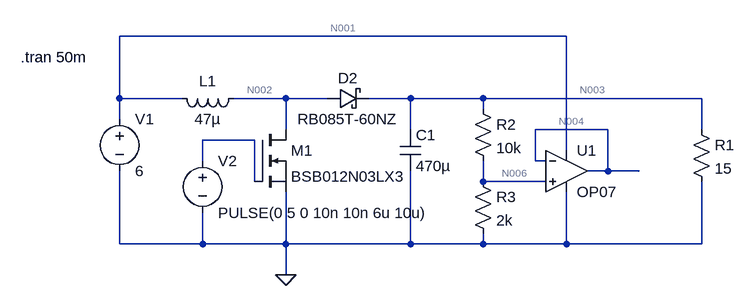
[diagram p0: schematic boost_DC-DC.asc]
boost_DC-DC.asc, the LTspice schematic file:
Version 4.1
SHEET 1 976 680
WIRE 672 -80 -16 -80
WIRE -16 16 -16 -80
WIRE 80 16 -16 16
WIRE 240 16 160 16
WIRE 304 16 240 16
WIRE 432 16 368 16
WIRE 544 16 432 16
WIRE 880 16 544 16
WIRE 544 32 544 16
WIRE -16 48 -16 16
WIRE 240 64 240 16
WIRE 432 64 432 16
WIRE 736 64 624 64
WIRE 880 64 880 16
WIRE 192 80 112 80
WIRE 672 96 672 -80
WIRE 112 112 112 80
WIRE 624 112 624 64
WIRE 640 112 624 112
WIRE 736 128 736 64
WIRE 736 128 704 128
WIRE 784 128 736 128
WIRE 192 144 192 80
WIRE 544 144 544 112
WIRE 640 144 544 144
WIRE -16 240 -16 128
WIRE 112 240 112 192
WIRE 112 240 -16 240
WIRE 240 240 240 160
WIRE 240 240 112 240
WIRE 432 240 432 128
WIRE 432 240 240 240
WIRE 544 240 544 224
WIRE 544 240 432 240
WIRE 672 240 672 160
WIRE 672 240 544 240
WIRE 880 240 880 144
WIRE 880 240 672 240
WIRE 240 288 240 240
FLAG 240 288 0
SYMBOL voltage -16 32 R0
WINDOW 123 0 0 Left 0
WINDOW 39 0 0 Left 0
SYMATTR InstName V1
SYMATTR Value 6
SYMBOL ind 64 0 M90
WINDOW 0 5 56 VBottom 2
WINDOW 3 32 56 VTop 2
SYMATTR InstName L1
SYMATTR Value 47µ
SYMATTR SpiceLine Rser=0.02
SYMBOL nmos 192 64 R0
SYMATTR InstName M1
SYMATTR Value BSB012N03LX3
SYMBOL cap 416 64 R0
SYMATTR InstName C1
SYMATTR Value 470µ
SYMATTR SpiceLine Rser=0.01
SYMBOL res 864 48 R0
SYMATTR InstName R1
SYMATTR Value 15
SYMBOL voltage 112 96 R0
WINDOW 123 0 0 Left 0
WINDOW 39 0 0 Left 0
SYMATTR InstName V2
SYMATTR Value PULSE(0 5 0 10n 10n 6u 10u)
SYMBOL schottky 304 32 R270
WINDOW 0 32 32 VTop 2
WINDOW 3 0 32 VBottom 2
SYMATTR InstName D2
SYMATTR Value RB085T-60NZ
SYMBOL res 528 16 R0
SYMATTR InstName R2
SYMATTR Value 10k
SYMBOL res 528 128 R0
SYMATTR InstName R3
SYMATTR Value 2k
SYMBOL OpAmps\\OP07 672 64 R0
SYMATTR InstName U1
TEXT -168 -48 Left 2 !.tran 50m

The netlist it stands for:
* boost_DC-DC.asc
V1 N001 0 6
L1 N001 N002 47µ Rser=0.02
M1 N002 N005 0 0 BSB012N03LX3
C1 N003 0 470µ Rser=0.01
R1 N003 0 15
V2 N005 0 PULSE(0 5 0 10n 10n 6u 10u)
D2 N002 N003 RB085T-60NZ
R2 N003 N006 10k
R3 N006 0 2k
X§U1 N006 N004 N001 0 N004 LT1001  ; OP07, pins In+ In- V+ V- OUT
.model D D
.lib standard.dio
.model NMOS NMOS
.model PMOS PMOS
.lib standard.mos
.tran 50m
.lib LTC.lib
.backanno
.end

* Results of the author's LTspice run, read from the files saved beside the schematic
* Operating Point, zero values left out:
*   V(n001) = 6 V
*   V(n002) = 5.992 V
*   V(n003) = 5.657 V
*   V(n004) = 944.1 mV
*   V(n006) = 942.8 mV
*   I(D2) = 377.6 mA
*   I(L1) = 377.6 mA
*   I(R1) = 377.1 mA
*   I(R2) = 471.4 µA
*   I(R3) = 471.4 µA
*   I(V1) = -379.8 mA
*   Id(M1) = 90.44 pA
*   Is(M1) = -90.44 pA
*   Ix(u1:1) = -21.98 pA
*   Ix(u1:2) = 14.64 pA
*   Ix(u1:3) = 2.25 mA
*   Ix(u1:4) = -2.25 mA
*   Ix(u1:5) = -10.53 pA